# EAGLE schematic TCB_MAIN (EAGLE 9.2.0)
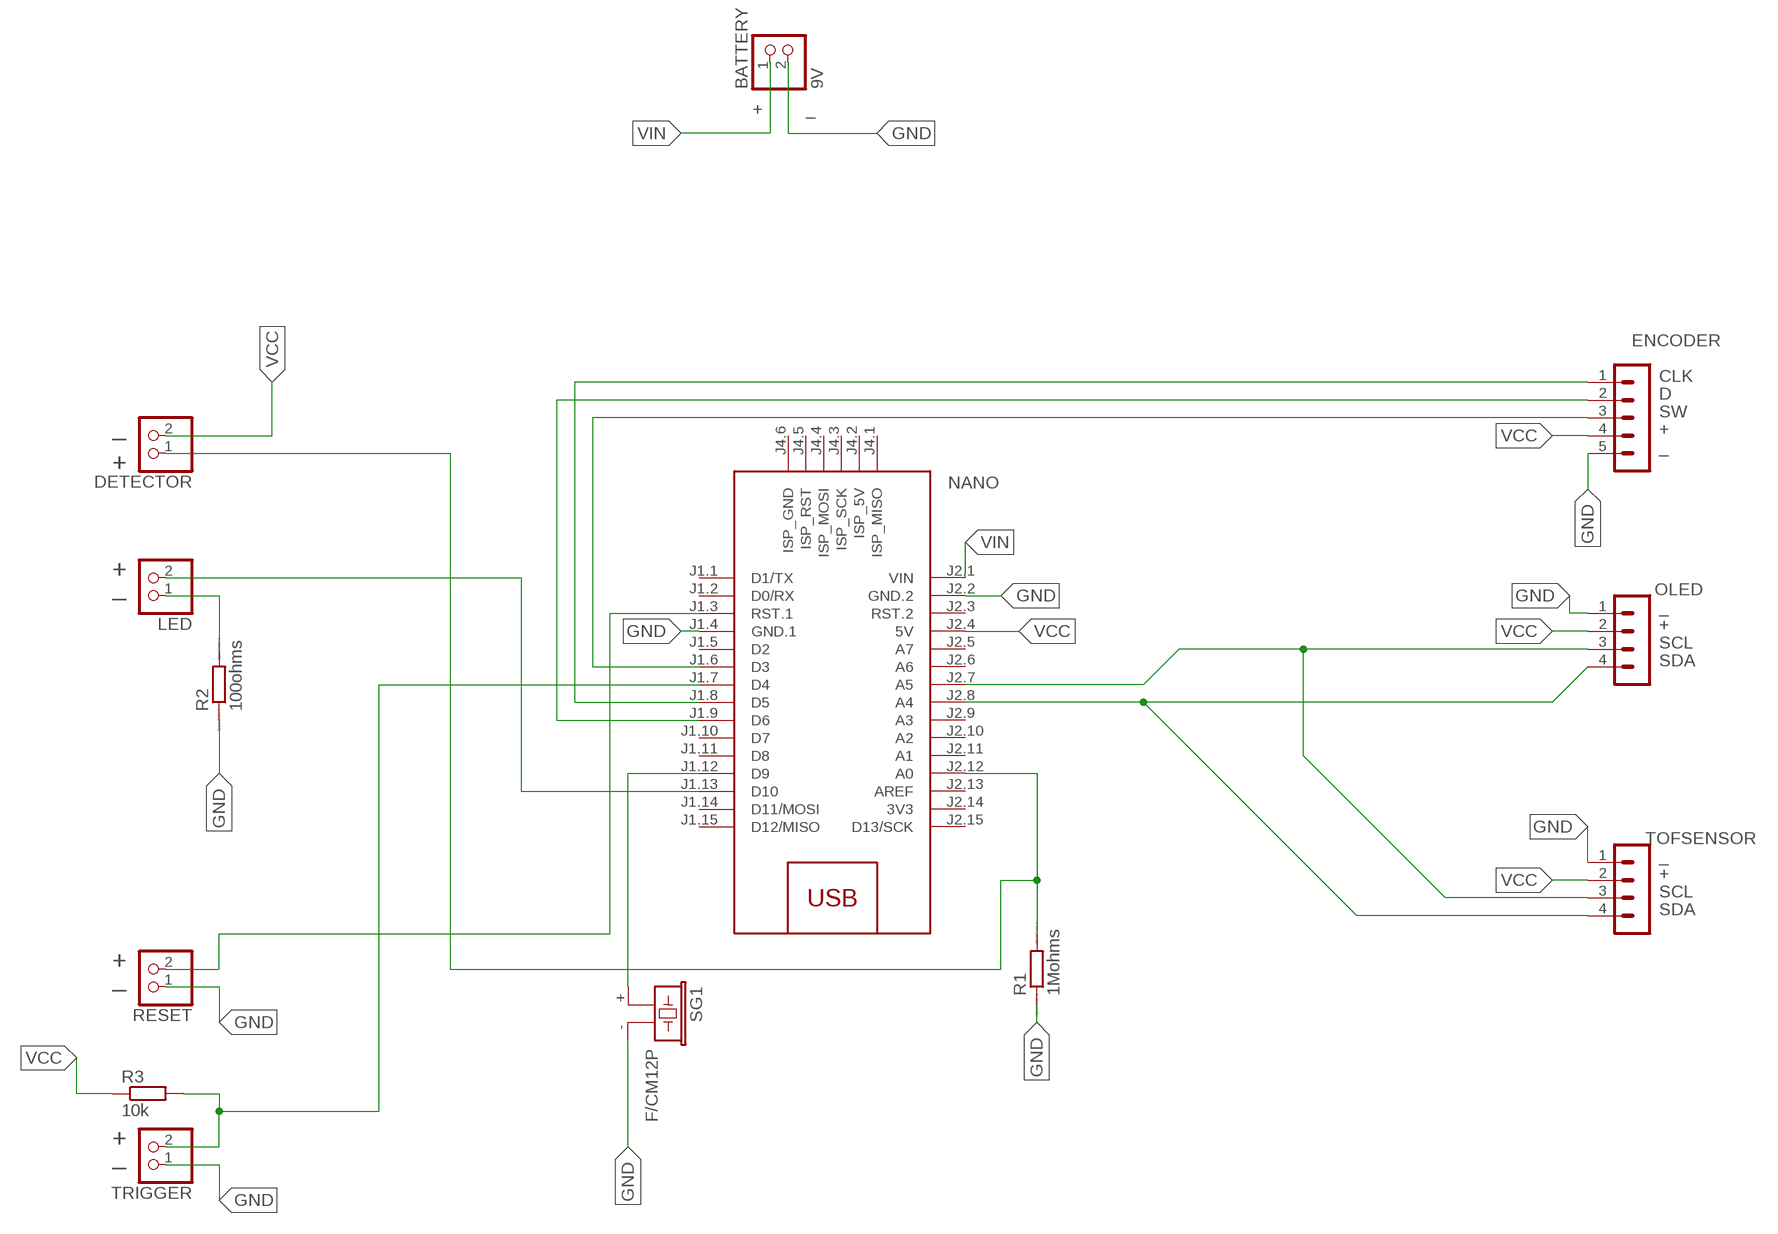
[diagram p0: schematic, sheet 1]

## Parts
BATTERY  9V  PINHD-1X2  [1X02]
DETECTOR  PINHD-1X2  [1X02]
ENCODER  MA05-1  [MA05-1]
LED  PINHD-1X2  [1X02]
NANO  ARDUINO-NANO-3.0#ISP  [ARDUINO-NANO-3.0#ISP]
OLED  MA04-1  [MA04-1]
R1  1Mohms  R0204/7  [0204/7]
R2  100ohms  R0204/7  [0204/7]
R3  10k  R-EU_0204/7  [0204/7]
RESET  PINHD-1X2  [1X02]
SG1  F/CM12P  [F/CM12P]
TOFSENSOR  MA04-1  [MA04-1]
TRIGGER  PINHD-1X2  [1X02]

## Nets
GND: BATTERY.2 ENCODER.5 NANO.J1.4(GND.1) NANO.J2.2(GND.2) OLED.1 R1.1 R2.1 RESET.1 SG1.- TOFSENSOR.1 TRIGGER.1
N$1: LED.1 R2.2
N$2: NANO.J1.12(D9) SG1.+
N$4: LED.2 NANO.J1.13(D10)
N$5: ENCODER.1 NANO.J1.8(D5)
N$6: ENCODER.2 NANO.J1.9(D6)
N$7: ENCODER.3 NANO.J1.6(D3)
N$8: DETECTOR.1 NANO.J2.12(A0) R1.2
N$9: NANO.J1.3(RST.1) RESET.2
N$11: NANO.J2.7(A5) OLED.3 TOFSENSOR.3
N$12: NANO.J1.7(D4) R3.2 TRIGGER.2
N$13: NANO.J2.8(A4) OLED.4 TOFSENSOR.4
VCC: DETECTOR.2 ENCODER.4 NANO.J2.4(5V) OLED.2 R3.1 TOFSENSOR.2
VIN: BATTERY.1 NANO.J2.1(VIN)
Unconnected: NANO.J1.1(D1/TX) NANO.J1.2(D0/RX) NANO.J1.5(D2) NANO.J1.10(D7) NANO.J1.11(D8) NANO.J1.14(D11/MOSI) NANO.J1.15(D12/MISO) NANO.J2.3(RST.2) NANO.J2.5(A7) NANO.J2.6(A6) NANO.J2.9(A3) NANO.J2.10(A2) NANO.J2.11(A1) NANO.J2.13(AREF) NANO.J2.15(D13/SCK) NANO.J4.1(ISP_MISO) NANO.J4.2(ISP_5V) NANO.J4.3(ISP_SCK) NANO.J4.4(ISP_MOSI) NANO.J4.5(ISP_RST) NANO.J4.6(ISP_GND)

## Notes on the sheet
- + | _
- CLK
- D
- SW
- _ | +
- _
- +
- +
- _
- _
- +
- SCL
- SDA
- _
- +
- SCL
- SDA
- +
- _
- +
- _

## Power pins joined to a net without a drawn wire
3V3: NANO.J2.14(3V3)

## Library data of the parts
BATTERY DETECTOR LED RESET TRIGGER = pinhead:PINHD-1X2: PIN HEADER
ENCODER = con-lstb:MA05-1: PIN HEADER; OC_FARNELL: unknown; OC_NEWARK: unknown
NANO = diy-modules:ARDUINO-NANO-3.0#ISP: Arduino Nano 3.0 (and compatible devices) with ISP pads More details available here: https://www.arduino.cc/en/Main/ArduinoBoardNano Click here to find device on ebay.com <http://www.ebay.com/sch/arduino+nano>
OLED TOFSENSOR = con-lstb:MA04-1: PIN HEADER; OC_FARNELL: unknown; OC_NEWARK: unknown
R1 R2 = eagle-ltspice:R: RESISTOR, European symbol; SPICEMODEL: NONE; SPICEPREFIX: R
R3 = rcl:R-EU_: RESISTOR, European symbol; SPICEPREFIX: R
SG1 = buzzer:F/CM12P: BUZZER Source: Buerklin; OC_FARNELL: unknown; OC_NEWARK: unknown